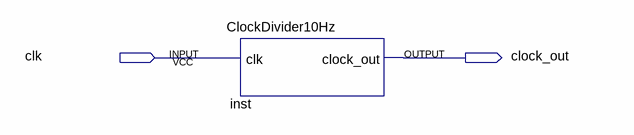
[diagram p0: schematic sheet]
// Quartus schematic testclock20hz.bdf as structural Verilog: 1 symbols, 2 pins
module testclock20hz (
  input  clk,
  output clock_out
);

  ClockDivider10Hz inst (.clk(clk), .clock_out(clock_out));
endmodule
